# EAGLE design Penetrometer_V3_PCB (EAGLE 9.5.2)
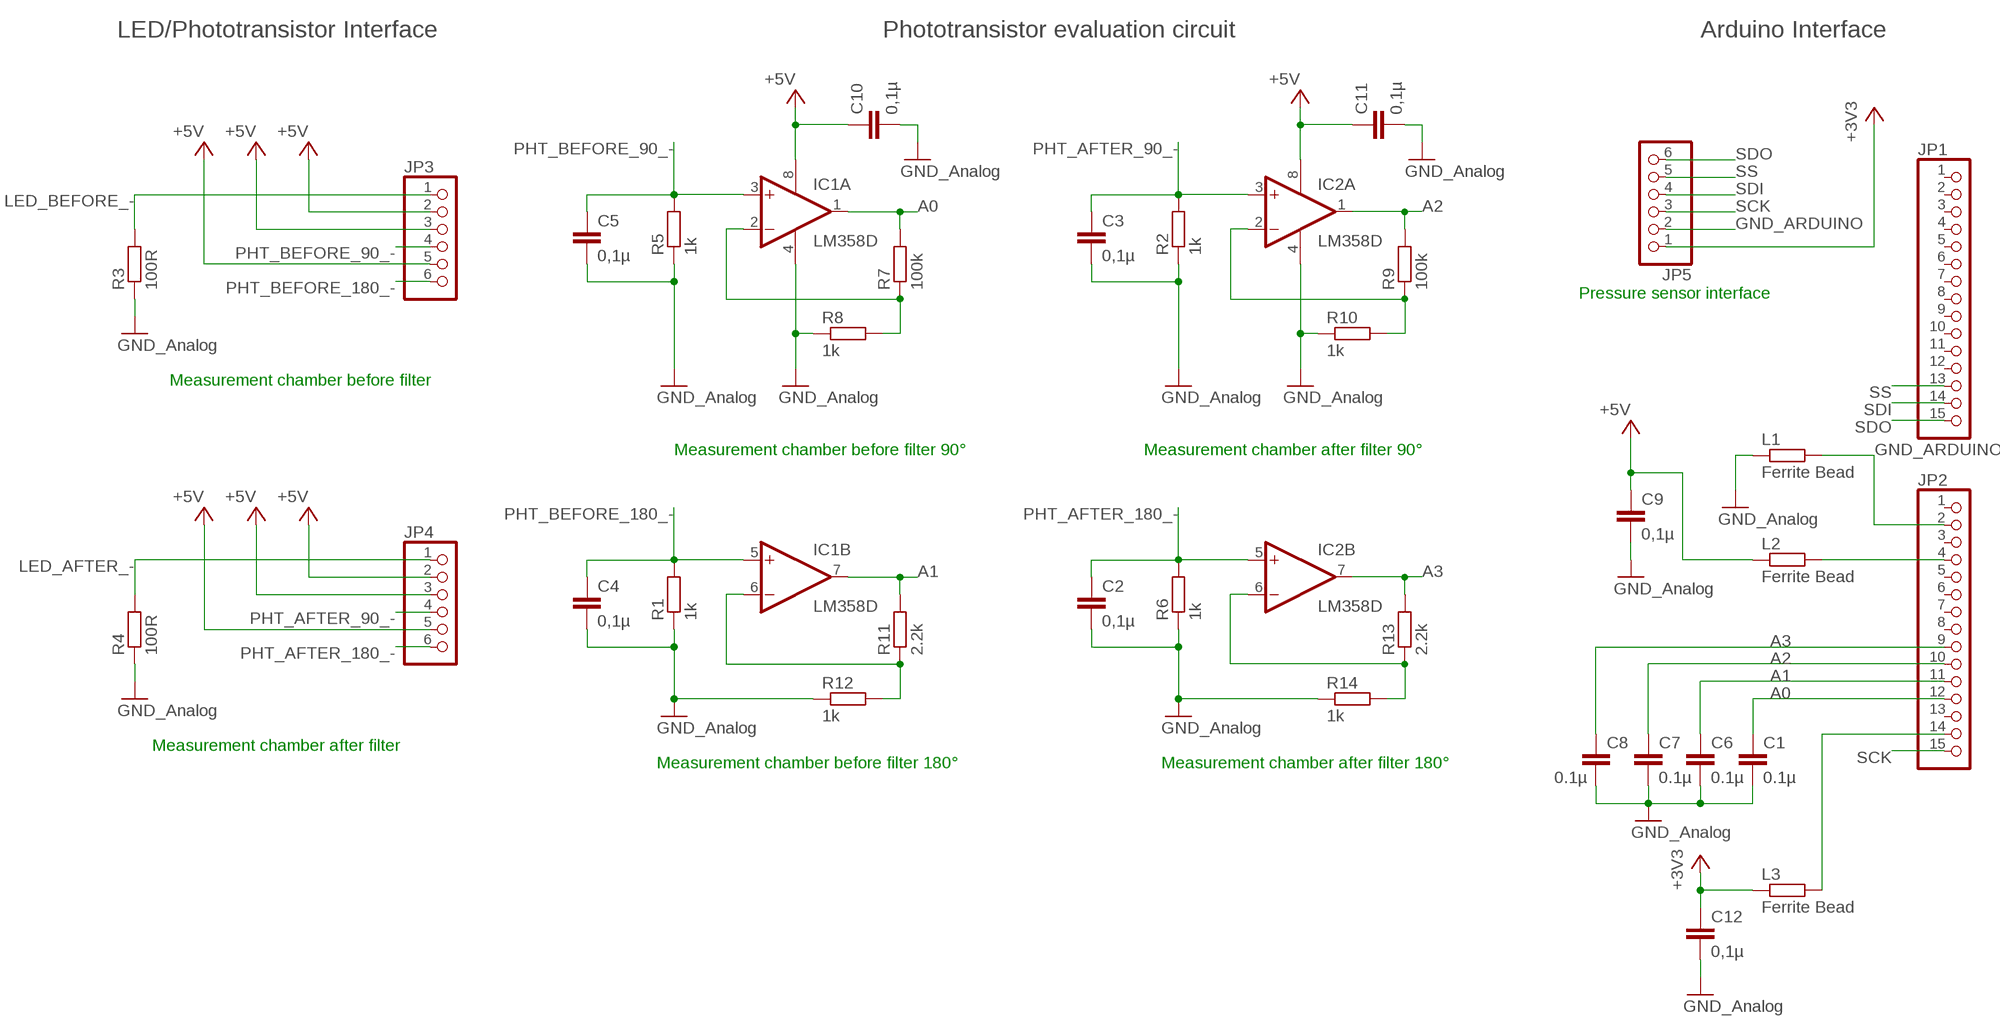
[diagram p0: schematic, sheet 1]

## Parts
C1  0.1µ  C-EUC0603K  [C0603K]
C2  0,1µ  C-EUC0603K  [C0603K]
C3  0,1µ  C-EUC0603K  [C0603K]
C4  0,1µ  C-EUC0603K  [C0603K]
C5  0,1µ  C-EUC0603K  [C0603K]
C6  0.1µ  C-EUC0603K  [C0603K]
C7  0.1µ  C-EUC0603K  [C0603K]
C8  0.1µ  C-EUC0603K  [C0603K]
C9  0,1µ  C-EUC0603K  [C0603K]
C10  0,1µ  C-EUC0603K  [C0603K]
C11  0,1µ  C-EUC0603K  [C0603K]
C12  0,1µ  C-EUC0603K  [C0603K]
IC1  LM358D  [SO08]
IC2  LM358D  [SO08]
JP1  PINHD-1X15  [1X15]
JP2  PINHD-1X15  [1X15]
JP3  PINHD-1X6  [1X06]
JP4  PINHD-1X6  [1X06]
JP5  PINHD-1X6  [1X06]
L1  Ferrite Bead  R-EU_R0603  [R0603]
L2  Ferrite Bead  R-EU_R0603  [R0603]
L3  Ferrite Bead  R-EU_R0603  [R0603]
R1  1k  R-EU_R0603  [R0603]
R2  1k  R-EU_R0603  [R0603]
R3  100R  R-EU_R0603  [R0603]
R4  100R  R-EU_R0603  [R0603]
R5  1k  R-EU_R0603  [R0603]
R6  1k  R-EU_R0603  [R0603]
R7  100k  R-EU_R0603  [R0603]
R8  1k  R-EU_R0603  [R0603]
R9  100k  R-EU_R0603  [R0603]
R10  1k  R-EU_R0603  [R0603]
R11  2.2k  R-EU_R0603  [R0603]
R12  1k  R-EU_R0603  [R0603]
R13  2.2k  R-EU_R0603  [R0603]
R14  1k  R-EU_R0603  [R0603]

## Nets
+3V3: C12.1 JP5.1 L3.1
+5V: C9.1 C10.1 C11.1 IC1.8(P:V+) IC2.8(P:V+) JP3.2 JP3.3 JP3.5 JP4.2 JP4.3 JP4.5 L2.1
A0: C1.1 IC1.1(A:OUT) JP2.12 R7.2
A1: C6.1 IC1.7(B:OUT) JP2.11 R11.2
A2: C7.1 IC2.1(A:OUT) JP2.10 R9.2
A3: C8.1 IC2.7(B:OUT) JP2.9 R13.2
GND: C1.2 C2.2 C3.2 C4.2 C5.2 C6.2 C7.2 C8.2 C9.2 C10.2 C11.2 C12.2 IC1.4(P:V-) IC2.4(P:V-) L1.1 R1.1 R2.1 R3.1 R4.1 R5.1 R6.1 R8.1 R10.1 R12.1 R14.1 ; supply symbol labelled GND_Analog
GND_ARDUINO: JP2.2 JP5.2 L1.2
LED_AFTER_-: JP4.1 R4.2
LED_BEFORE_-: JP3.1 R3.2
N$2: JP2.4 L2.2
N$3: IC1.2(A:-IN) R7.1 R8.2
N$4: IC2.2(A:-IN) R9.1 R10.2
N$5: IC1.6(B:-IN) R11.1 R12.2
N$6: IC2.6(B:-IN) R13.1 R14.2
N$7: JP2.14 L3.2
PHT_AFTER_90_-: C3.1 IC2.3(A:+IN) JP4.4 R2.2
PHT_AFTER_180_-: C2.1 IC2.5(B:+IN) JP4.6 R6.2
PHT_BEFORE_90_-: C5.1 IC1.3(A:+IN) JP3.4 R5.2
PHT_BEFORE_180_-: C4.1 IC1.5(B:+IN) JP3.6 R1.2
SCK: JP2.15 JP5.3
SDI: JP1.14 JP5.4
SDO: JP1.15 JP5.6
SS: JP1.13 JP5.5
Unconnected: JP1.1 JP1.2 JP1.3 JP1.4 JP1.5 JP1.6 JP1.7 JP1.8 JP1.9 JP1.10 JP1.11 JP1.12 JP2.1 JP2.3 JP2.5 JP2.6 JP2.7 JP2.8 JP2.13

## Notes on the sheet
- LED/Phototransistor Interface | Phototransistor evaluation circuit | Arduino Interface
- Pressure sensor interface
- Measurement chamber before filter
- Measurement chamber before filter 90° | Measurement chamber after filter 90°
- Measurement chamber after filter
- Measurement chamber before filter 180° | Measurement chamber after filter 180°

## Library data of the parts
C1-C12 = rcl:C-EU: CAPACITOR, European symbol; SPICEPREFIX: C
IC1 IC2 = linear:LM358: OP AMP also LM158; LM258; LM2904 Source: http://cache.national.com/ds/LM/LM158.pdf
JP1 JP2 = pinhead:PINHD-1X15: PIN HEADER
JP3-JP5 = pinhead:PINHD-1X6: PIN HEADER
L1-L3 R1-R14 = rcl:R-EU_: RESISTOR, European symbol; SPICEPREFIX: R

## Net classes
0 default: clearance 0.205 mm

## Board
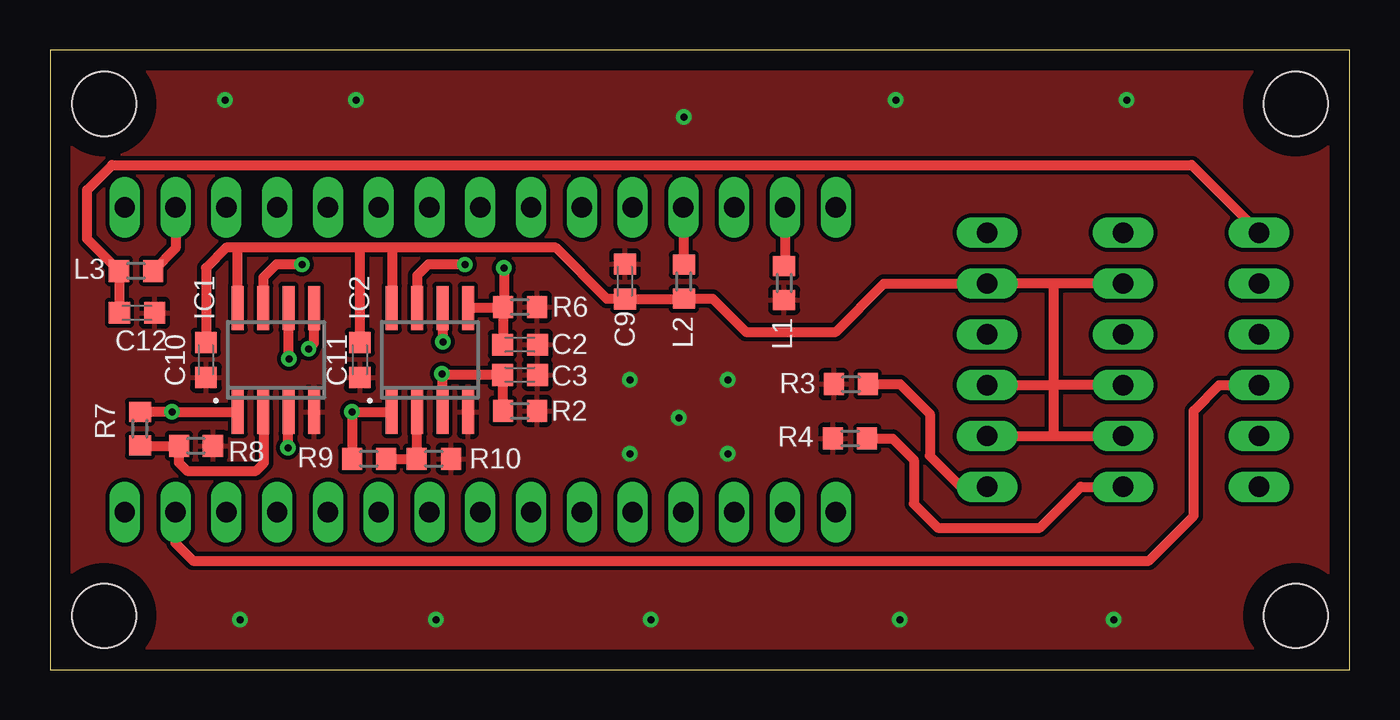
[diagram p1: board, top side]
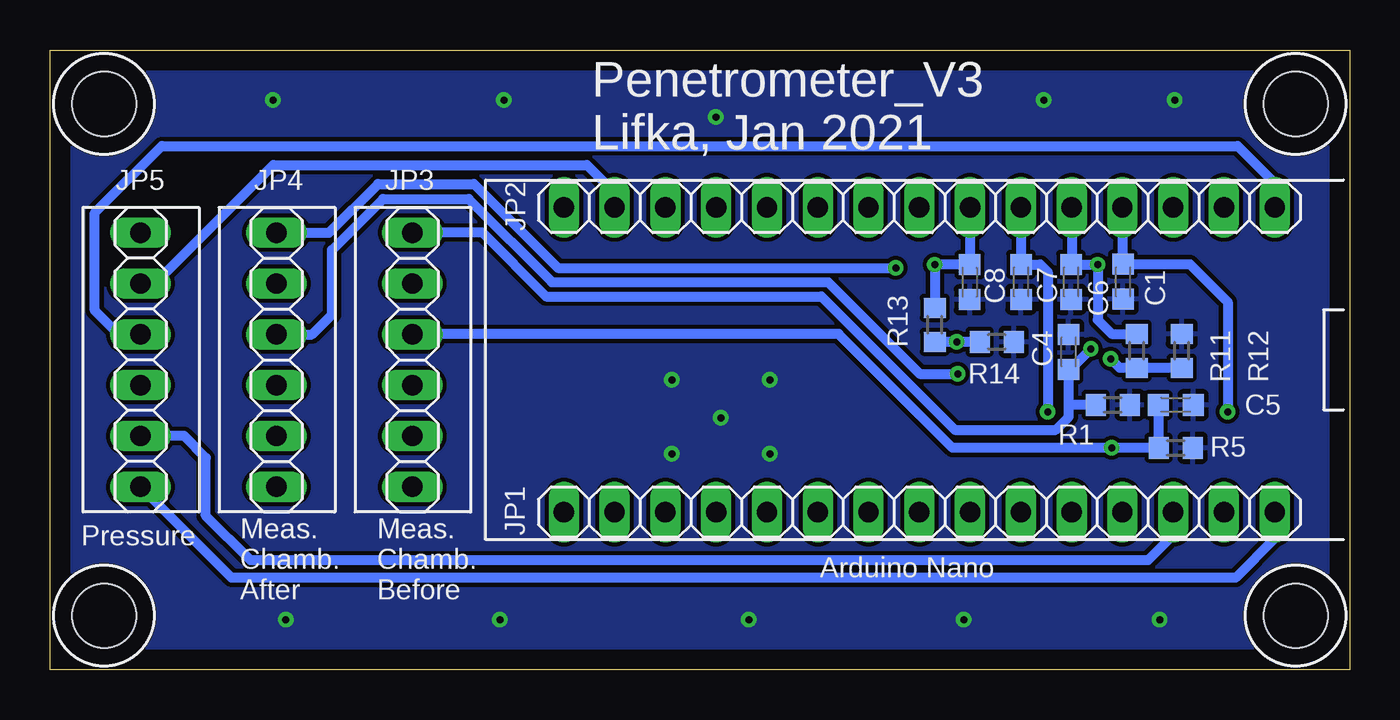
[diagram p2: board, bottom side, seen from below]

Size 65 x 31 mm. Coordinates in mm from the lower left corner, seen from the top.
Outline: 0,0 65,0 65,31 0,31 0,0
Copper layers (1*16): Top 0.035mm / dielectric 1.5mm / Bottom 0.035mm
Design rules "default": minimum track width 6mil, minimum drill 0.35mm, track to track 6mil, track to pad 6mil, pad to pad 6mil, via to via 6mil, smd to smd 6mil, copper to edge 40mil, drill to drill 6mil, minimum pad ring 10mil, minimum via ring 8mil, stop-mask expansion 4mil, vias tented up to drill 0mil, thermal gap 10mil
Holes 3.2 mm at 2.7,28.3 2.7,2.7 62.3,28.3 62.3,2.7

### Footprints (pad centres in the part's own frame; a part is rotated, then mirrored left to right if it is on the bottom)
C0603K = smd 1.05 x 1.08: 1 -0.875,0; 2 0.875,0
SO08 = smd 0.6 x 2.2: 1 -1.905,-2.6; 2 -0.635,-2.6; 3 0.635,-2.6; 4 1.905,-2.6; 5 1.905,2.6; 6 0.635,2.6; 7 -0.635,2.6; 8 -1.905,2.6
1X15 = drill 1.016 long: 1 -17.78,0; 2 -15.24,0; 3 -12.7,0; 4 -10.16,0; 5 -7.62,0; 6 -5.08,0; 7 -2.54,0; 8 0,0; 9 2.54,0; 10 5.08,0; 11 7.62,0; 12 10.16,0; 13 12.7,0; 14 15.24,0; 15 17.78,0
1X06 = drill 1.016 long: 1 -6.35,0; 2 -3.81,0; 3 -1.27,0; 4 1.27,0; 5 3.81,0; 6 6.35,0
R0603 = smd 1 x 1.1: 1 -0.85,0; 2 0.85,0

### Placement (x,y rotation side)
C1  11.33,19.41 270 bottom
C2  23.5,16.26 0 top
C3  23.5,14.74 0 top
C4  14.06,15.9 90 bottom
C5  8.7,13.24 0 bottom
C6  13.93,19.4 270 bottom
C7  16.43,19.39 270 bottom
C8  19,19.38 270 bottom
C9  28.76,19.42 90 top
C10  7.8,15.5 270 top
C11  15.5,15.5 270 top
C12  4.35,17.85 0 top
IC1  11.3,15.5 0 top
IC2  19,15.5 0 top
JP1  21.52,7.88 0 bottom
JP2  21.52,23.12 0 bottom
JP3  46.87,15.5 90 bottom
JP4  53.67,15.5 90 bottom
JP5  60.47,15.5 270 bottom
L1  36.72,19.34 90 top
L2  31.7,19.41 90 top
L3  4.3,19.95 0 top
R1  11.85,13.24 180 bottom
R2  23.5,12.94 180 top
R3  40.06,14.28 0 top
R4  40.02,11.56 0 top
R5  8.7,11.09 180 bottom
R6  23.5,18.14 180 top
R7  4.5,12.05 90 top
R8  7.3,11.2 180 top
R9  15.95,10.55 180 top
R10  19.2,10.55 180 top
R11  10.65,15.95 90 bottom
R12  8.4,15.95 270 bottom
R13  20.75,17.25 90 bottom
R14  17.65,16.4 180 bottom

### Tracks (layer width: path | path; a pad name or v marks a point on that pad's centre or on a via)
+3V3
  Top 0.508: C12.1 3.48,19.93 L3.1 1.85,21.55 1.85,24 3.1,25.25 57.1,25.25 60.47,21.88 JP5.1
+5V
  Top 0.508: JP4.5 50.2,19.31 | 50.2,19.31 JP3.5 41.71,19.31 39.3,16.9 34.8,16.9 33.14,18.56 L2.1 31.68,18.55 C9.1 27.86,18.55 25.3,21.1 17.1,21.1 | JP4.3 50.2,14.23 | JP3.3 50.2,14.23 | 17.1,21.1 IC2.8 | 17.1,21.1 15.5,21.1 | 15.5,21.1 9.4,21.1 | 9.4,21.1 8.8,21.1 7.8,20.1 C10.1 | C11.1 15.5,21.1 | IC1.8 9.39,21.09 9.4,21.1 | JP3.2 50.3,11.69 | 50.3,11.69 JP4.2 | 50.3,11.69 50.2,11.79 50.2,14.23 | 50.2,14.23 50.2,19.31
A0  (via drill 0.35)
  Top 0.508: IC1.1 v6.1,12.9 R7.2
  Bottom 0.508: JP2.12 11.36,20.32 C1.1 7.99,20.29 6.1,18.4 v6.1,12.9
A1  (via drill 0.35)
  Top 0.508: v12.6,20.26 11.31,20.26 10.66,19.61 IC1.7
  Bottom 0.508: JP2.11 13.9,20.3 C6.1 12.61,20.27 v12.6,20.26 12.6,17.5 11.9,16.8 R11.2
A2  (via drill 0.35)
  Top 0.508: IC2.1 v15.1,12.9 R9.2
  Bottom 0.508: JP2.10 C7.1 15.46,20.27 15.1,19.9 v15.1,12.9
A3  (via drill 0.35)
  Top 0.508: v20.75,20.26 18.91,20.26 18.36,19.71 IC2.7
  Bottom 0.508: JP2.9 18.98,20.27 C8.1 v20.74,20.25 v20.75,20.26 R13.2
GND  (via drill 0.35)
  other vias: 8.75,28.5 31.7,27.65 15.3,28.5 42.3,28.5 9.5,2.5 19.3,2.5 30.05,2.5 42.5,2.5 53.2,2.5 33.9,10.8 29,10.8 31.45,12.6 29,14.5 33.9,14.5 53.85,28.5
  pour Top: -0.35,-0.35 -0.35,31.7 65.85,31.7 65.85,-0.35
  pour Bottom: -0.5,-0.55 -0.5,32 65.5,32 65.5,-0.55
GND_ARDUINO
  Top 0.508: JP2.2 36.76,20.23 L1.2
  Bottom 0.508: JP5.2 59.77,19.31 53.83,25.25 38.15,25.25 36.76,23.86 JP2.2
LED_AFTER_-
  Top 0.508: R4.2 42.14,11.56 43.2,10.5 43.2,8.3 44.4,7.1 49.5,7.1 51.55,9.15 JP4.1
LED_BEFORE_-
  Top 0.508: R3.2 42.52,14.28 44,12.8 44,10.7 45.55,9.15 JP3.1
N$2
  Top 0.508: JP2.4 31.68,20.28 L2.2
N$3
  Top 0.508: IC1.2 10.7,12.87 10.7,10.35 10.3,9.95 6.85,9.95 6.45,10.35 R8.2 R7.1
N$4
  Top 0.508: R9.1 R10.2 18.35,12.88 IC2.2
N$5  (via drill 0.35)
  Top 0.508: v11.95,15.55 11.94,15.56 IC1.6
  Bottom 0.508: R12.2 R11.1 11.5,15.1 v11.95,15.55
N$6  (via drill 0.35)
  Top 0.508: IC2.6 19.64,16.41 v19.65,16.4
  Bottom 0.508: R14.2 v19.65,16.4 R13.1
N$7
  Top 0.508: JP2.14 6.28,21.08 L3.2
PHT_AFTER_90_-  (via drill 0.35)
  Top 0.508: IC2.3 19.6,12.94 v19.6,14.8 19.66,14.74 C3.1 22.65,14.71 R2.2
  Bottom 0.508: JP4.4 51.9,16.77 50.9,17.77 50.9,20.99 48.35,23.55 44.05,23.55 39.9,19.39 26.09,19.39 21.5,14.8 v19.6,14.8
PHT_AFTER_180_-  (via drill 0.35)
  Top 0.508: R6.2 22.61,18.1 IC2.5 | v22.7,20.1 22.7,18.19 R6.2 | R6.2 22.65,16.29 C2.1
  Bottom 0.508: v22.7,20.1 39.6,20.1 43.8,24.3 48.6,24.3 51.05,21.85 JP4.6
PHT_BEFORE_90_-  (via drill 0.35)
  Top 0.508: v11.9,11.1 11.9,12.87 IC1.3
  Bottom 0.508: JP3.4 46.27,16.8 25.56,16.8 19.86,11.1 v11.9,11.1 v11.89,11.09 R5.2 9.57,11.12 C5.1
PHT_BEFORE_180_-  (via drill 0.35)
  Top 0.508: IC1.5 13.2,16.31 v12.94,16.05
  Bottom 0.508: JP3.6 43.37,21.85 40.19,18.67 26.42,18.67 19.75,12 14.7,12 14.05,12.65 14.05,13.2 | 14.05,13.2 14.05,15.02 C4.1 13.97,15.03 v12.95,16.05 v12.94,16.05 | R1.2 14.01,13.24 14.05,13.2
SCK
  Bottom 0.508: JP5.3 61.57,16.77 62.75,17.95 62.75,22.86 59.41,26.2 5.6,26.2 3.74,24.34 JP2.15
SDI
  Top 0.508: JP1.14 6.28,6.32 7.15,5.45 54.95,5.45 57.2,7.7 57.2,12.95 58.48,14.23 JP5.4
SDO
  Bottom 0.508: JP1.15 3.74,6.56 5.7,4.6 55.92,4.6 JP5.6
SS
  Bottom 0.508: JP1.13 8.82,6.73 10.09,5.46 54.96,5.46 57.2,7.7 57.2,10.6 58.29,11.69 JP5.5

### Text on the board
bNames: Penetrometer_V3 / Lifka, Jan 2021 | Pressure | Arduino Nano | Meas. / Chamb. / Before | Meas. / Chamb. / After